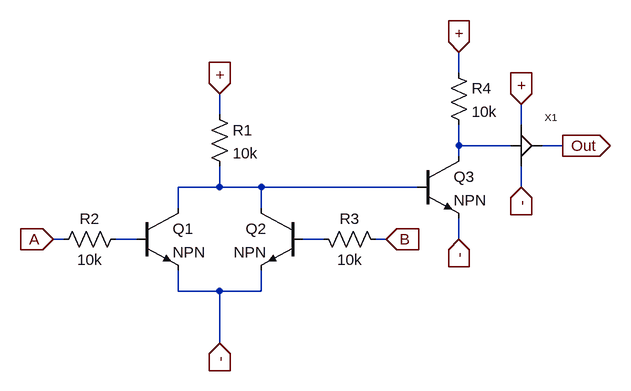
[diagram p0: schematic OR.asc]
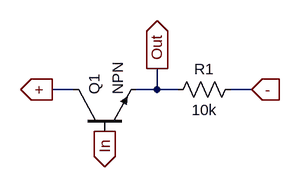
[diagram p1: sub-circuit buffer.asc]
OR.asc, the LTspice schematic file:
Version 4
SHEET 1 900 680
WIRE 608 -144 608 -176
WIRE 240 -80 240 -112
WIRE 704 -64 704 -96
WIRE 608 -32 608 -64
WIRE 688 -32 608 -32
WIRE 768 -32 736 -32
WIRE 608 -16 608 -32
WIRE 240 32 240 0
WIRE 240 32 176 32
WIRE 304 32 240 32
WIRE 544 32 304 32
WIRE 704 32 704 0
WIRE 176 64 176 32
WIRE 304 64 304 32
WIRE 0 112 -16 112
WIRE 112 112 80 112
WIRE 400 112 368 112
WIRE 496 112 480 112
WIRE 608 112 608 80
WIRE 176 192 176 160
WIRE 240 192 176 192
WIRE 304 192 304 160
WIRE 304 192 240 192
WIRE 240 272 240 192
FLAG 240 272 -
IOPIN 240 272 In
FLAG 240 -112 +
IOPIN 240 -112 In
FLAG -16 112 A
IOPIN -16 112 In
FLAG 496 112 B
IOPIN 496 112 In
FLAG 768 -32 Out
IOPIN 768 -32 Out
FLAG 608 112 -
IOPIN 608 112 In
FLAG 608 -176 +
IOPIN 608 -176 In
FLAG 704 -96 +
IOPIN 704 -96 In
FLAG 704 32 -
IOPIN 704 32 In
SYMBOL npn 112 64 R0
SYMATTR InstName Q1
SYMBOL npn 368 64 M0
SYMATTR InstName Q2
SYMBOL res 224 -96 R0
SYMATTR InstName R1
SYMATTR Value 10k
SYMBOL res 96 96 R90
WINDOW 0 0 56 VBottom 2
WINDOW 3 32 56 VTop 2
SYMATTR InstName R2
SYMATTR Value 10k
SYMBOL res 384 96 M90
WINDOW 0 0 56 VBottom 2
WINDOW 3 32 56 VTop 2
SYMATTR InstName R3
SYMATTR Value 10k
SYMBOL npn 544 -16 R0
SYMATTR InstName Q3
SYMBOL res 592 -160 R0
SYMATTR InstName R4
SYMATTR Value 10k
SYMBOL Buffer 688 -32 R0
SYMATTR InstName X1

buffer.asc, the sub-circuit schematic file:
Version 4
SHEET 1 880 680
WIRE 48 112 16 112
WIRE 176 112 176 80
WIRE 176 112 144 112
WIRE 208 112 176 112
WIRE 320 112 288 112
FLAG 176 80 Out
IOPIN 176 80 Out
FLAG 16 112 +
IOPIN 16 112 Out
FLAG 96 176 In
IOPIN 96 176 Out
FLAG 320 112 -
IOPIN 320 112 In
SYMBOL npn 48 176 R270
SYMATTR InstName Q1
SYMBOL res 304 96 R90
WINDOW 0 0 56 VBottom 2
WINDOW 3 32 56 VTop 2
SYMATTR InstName R1
SYMATTR Value 10k

The netlist it stands for:
* OR.asc
Q1 N002 N003 - 0 NPN
Q2 N002 N004 - 0 NPN
R1 + N002 10k
R2 N003 A 10k
R3 N004 B 10k
Q3 N001 N002 - 0 NPN
R4 + N001 10k
XX1 N001 Out + - buffer

* block symbol definitions
.subckt buffer In Out + -
Q1 + In Out 0 NPN
R1 - Out 10k
.ends buffer

.model NPN NPN
.model PNP PNP
.lib standard.bjt
.backanno
.end